# Altium schematic sheet IO2.SchDoc
size A4
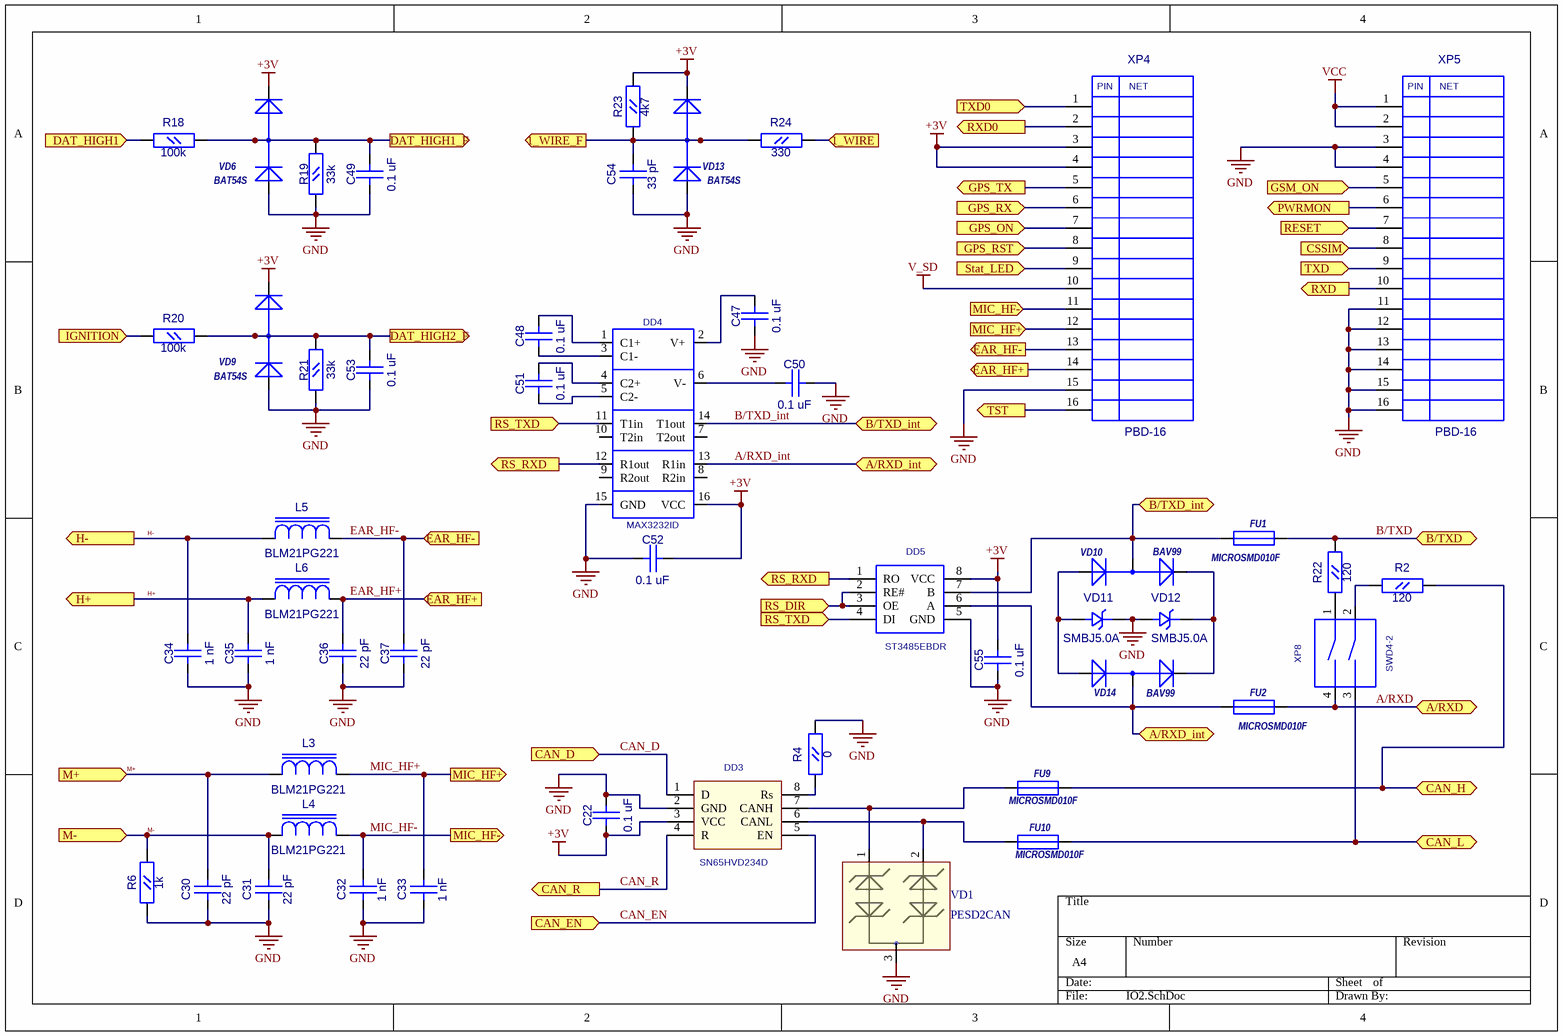
[diagram p0: IO2.SchDoc]

## Parts
C22  0.1 uF  [CC0603]
C30  22 pF  [CC0603]
C31  22 pF  [CC0603]
C32  1 nF  [CC0603]
C33  1 nF  [CC0603]
C34  1 nF  [CC0603]
C35  1 nF  [CC0603]
C36  22 pF  [CC0603]
C37  22 pF  [CC0603]
C47  0.1 uF  [CC0603]
C48  0.1 uF  [CC0603]
C49  0.1 uF  [CC0603]
C50  0.1 uF  [CC0603]
C51  0.1 uF  [CC0603]
C52  0.1 uF  [CC0603]
C53  0.1 uF  [CC0603]
C54  33 pF  [CC0603]
C55  0.1 uF  [CC0603]
DD3  SN65HVD234D  [SO-8]
DD4  MAX3232ID  [SO16_M]
DD5  ST3485EBDR  [SO-8]
FU1  MICROSMD010F  [FUSE_1210]
FU2  MICROSMD010F  [FUSE_1210]
FU9  MICROSMD010F  [FUSE_1210]
FU10  MICROSMD010F  [FUSE_1210]
L3  BLM21PG221  [RC0805]
L4  BLM21PG221  [RC0805]
L5  BLM21PG221  [RC0805]
L6  BLM21PG221  [RC0805]
R2  120  [RC0805]
R4  0  [RC0603]
R6  1k  [RC0603]
R18  100k  [RC0603]
R19  33k  [RC0603]
R20  100k  [RC0603]
R21  33k  [RC0603]
R22  120  [RC0805]
R23  4k7  [RC0603]
R24  330  [RC0603]
VD1  PESD2CAN  [SOT-23(123)]
VD6  BAT54S  [SOT-23(GSD)]
VD9  BAT54S  [SOT-23(GSD)]
VD10  BAV99  [SOT-23(GSD)]
VD11  SMBJ5.0A  [SMB]
VD12  SMBJ5.0A  [SMB]
VD13  BAT54S  [SOT-23(GSD)]
VD14  BAV99  [SOT-23(GSD)]
XP4  PBD-16  [PBD16]
XP5  PBD-16  [PBD16]
XP8  SWD4-2  [SWD4-2]

## Ports
1_WIRE (in), 1_WIRE_F (out), A/RXD, A/RXD_int, B/TXD, B/TXD_int, CAN_D (in), CAN_EN (in), CAN_H (bidir), CAN_L (bidir), CAN_R (out), CSSIM (in), DAT_HIGH1 (in), DAT_HIGH1_F (out), DAT_HIGH2_F (out), EAR_HF+ (in), EAR_HF+ (out), EAR_HF- (in), EAR_HF- (out), GPS_ON (in), GPS_RST (in), GPS_RX (in), GPS_TX (out), GSM_ON (in), H+ (out), H- (out), IGNITION (in), M+ (in), M- (in), MIC_HF+ (in), MIC_HF+ (out), MIC_HF- (in), MIC_HF- (out), PWRMON (out), RESET (in), RS_DIR (in), RS_RXD (out), RS_TXD (in), RXD0 (out), RXD (out), Stat_LED (in), TST (out), TXD0 (in), TXD (in)

## Nets
+3V: C22.1(A) C52.2(B) C55.2(B) DD3.3(VCC) DD4.16(VCC) DD5.8(VCC) R23.1(A) VD6.2(K) VD9.2(K) VD13.2(K) XP4.3 XP4.4
GND: C22.2(B) C30.1(A) C31.1(A) C32.1(A) C33.1(A) C34.1(A) C35.1(A) C36.1(A) C37.1(A) C47.1(A) C49.1(A) C50.1(A) C52.1(A) C53.1(A) C54.1(A) C55.1(A) DD3.2(GND) DD4.15(GND) DD5.5(GND) R4.2(B) R6.1(A) R19.2(B) R21.2(B) VD1.3 VD6.1(A) VD9.1(A) VD11.2(K) VD12.1(A) VD13.1(A) XP4.15 XP5.3 XP5.4 XP5.11 XP5.12 XP5.13 XP5.14 XP5.15 XP5.16
V_SD: XP4.10
VCC: XP5.1 XP5.2
1_WIRE: R24.2(B) ; port 1_WIRE
1_WIRE_F: C54.2(B) R23.2(B) R24.1(A) VD13.3(AK) ; port 1_WIRE_F
A/RXD: FU2.1 XP8.4 ; port A/RXD
A/RXD_int: DD4.13(R1in) DD5.6(A) FU2.2 VD14.3(AK) ; port A/RXD_int
B/TXD: FU1.1 R22.2(B) ; port B/TXD
B/TXD_int: DD4.14(T1out) DD5.7(B) FU1.2 VD10.3(AK) ; port B/TXD_int
CAN_D: DD3.1(D) ; port CAN_D
CAN_EN: DD3.5(EN) ; port CAN_EN
CAN_H: FU9.1 R2.2(B) ; port CAN_H
CAN_L: FU10.1 XP8.3 ; port CAN_L
CAN_R: DD3.4(R) ; port CAN_R
CSSIM: XP5.8 ; port CSSIM
DAT_HIGH1: R18.2(B) ; port DAT_HIGH1
DAT_HIGH1_F: C49.2(B) R18.1(A) R19.1(A) VD6.3(AK) ; port DAT_HIGH1_F
DAT_HIGH2_F: C53.2(B) R20.1(A) R21.1(A) VD9.3(AK) ; port DAT_HIGH2_F
EAR_HF+: C36.2(B) L6.1(A) XP4.14 ; port EAR_HF+
EAR_HF-: C37.2(B) L5.1(A) XP4.13 ; port EAR_HF-
GPS_ON: XP4.7 ; port GPS_ON
GPS_RST: XP4.8 ; port GPS_RST
GPS_RX: XP4.6 ; port GPS_RX
GPS_TX: XP4.5 ; port GPS_TX
GSM_ON: XP5.5 ; port GSM_ON
H+: C35.2(B) L6.2(B) ; port H+
H-: C34.2(B) L5.2(B) ; port H-
IGNITION: R20.2(B) ; port IGNITION
M+: C30.2(B) L3.1(A) ; port M+
M-: C31.2(B) L4.1(A) R6.2(B) ; port M-
MIC_HF+: C33.2(B) L3.2(B) XP4.12 ; port MIC_HF+
MIC_HF-: C32.2(B) L4.2(B) XP4.11 ; port MIC_HF-
PWRMON: XP5.6 ; port PWRMON
RESET: XP5.7 ; port RESET
RS_DIR: DD5.2(RE#) DD5.3(OE) ; port RS_DIR
RS_RXD: DD4.12(R1out) DD5.1(RO) ; port RS_RXD
RS_TXD: DD4.11(T1in) DD5.4(DI) ; port RS_TXD
RXD: XP5.10 ; port RXD
RXD0: XP4.2 ; port RXD0
Stat_LED: XP4.9 ; port Stat_LED
TST: XP4.16 ; port TST
TXD: XP5.9 ; port TXD
TXD0: XP4.1 ; port TXD0
NetC47_2: C47.2(B) DD4.2(V+)
NetC48_1: C48.1(A) DD4.3(C1-)
NetC48_2: C48.2(B) DD4.1(C1+)
NetC50_2: C50.2(B) DD4.6(V-)
NetC51_1: C51.1(A) DD4.5(C2-)
NetC51_2: C51.2(B) DD4.4(C2+)
NetDD3_6: DD3.6(CANL) FU10.2 VD1.2
NetDD3_7: DD3.7(CANH) FU9.2 VD1.1
NetDD3_8: DD3.8(Rs) R4.1(A)
NetR2_1: R2.1(A) XP8.2
NetR22_1: R22.1(A) XP8.1
NetVD10_1: VD10.1(A) VD11.1(A) VD14.1(A)
NetVD10_2: VD10.2(K) VD12.2(K) VD14.2(K)

Not connected (* = marked no-connect by the designer): DD4 7(T2out) 8(R2in) 9(R2out) 10(T2in)

## Notes on the sheet
- (in symbol PBD-16) PIN; NET

## Library data of the parts
C22 C30-C37 C47-C55 = CC0603
  C22 C47-C53 C55: Value: 0.1 uF
  C30 C31 C36 C37: Value: 22 pF
  C32-C35: Value: 1 nF
  C54: Value: 33 pF
DD3 = SN65HVD234D: CAN Transceiver; Value: *
DD4 = ST232BD/CD: Value: *
DD5 = SP485: Value: *
FU1 FU2 FU9 FU10 = MICROSMD: Value: MICROSMD010F
R2 R22 = RC0805: Value: 120
R4 R6 R18-R21 R23 R24 = RC0603
  R4: Value: 0
  R6: Value: 1k
  R18 R20: Value: 100k
  R19 R21: Value: 33k
  R23: Value: 4k7
  R24: Value: 330
VD1 = PESD2CAN: TVS for CAN
VD6 VD9 = BAT54S: ComponentField6: Published 8-Jun-2000, Modified 11-July-2000: SIM Model Added.; Value: *
VD10 VD14 = BAV99: 1.0 Ampere General Purpose Rectifier; ComponentField6: Published 8-Jun-2000, Modified 11-July-2000: SIM Model Added.; Value: *
VD11 VD12 = SMBJ: Value: *
VD13 = BAT54S: 1.0 Ampere General Purpose Rectifier; ComponentField6: Published 8-Jun-2000, Modified 11-July-2000: SIM Model Added.; Value: *
XP4 XP5 = PBD-16: Value: *
XP8 = SWD4-2: Value: *